# Altium schematic sheet JTAG&CONFIG.SchDoc: JTAG Chain +
size 420 x 297 mm; CheckedBy: MC, TW, EB; CompanyName: CERN; DrawnBy: Greg Kasprowicz; Organization: CERN; Address1: European Organization for Nuclear Research; Address2: CH-1211 Geneve 23 - Switzerland; DocumentNumber: 10; Revision: -; SheetNumber: 10; SheetTotal: 17; EDA_Number: EDA-02189-V4-0; Projet: Simple PCIe Carrier Board; ModifiedBy: TW, MC; CreateDate: 10/07/2010; CheckedDate: 11/05/2011; Title2: FPGA Flash; DivGrp: BE-CO; Designer: GK, MC, TW, EB, PAS; DocumentName: jtag_chain.SchDoc; ModifiedDate: -; Rule: PcbType=ProtelPcb
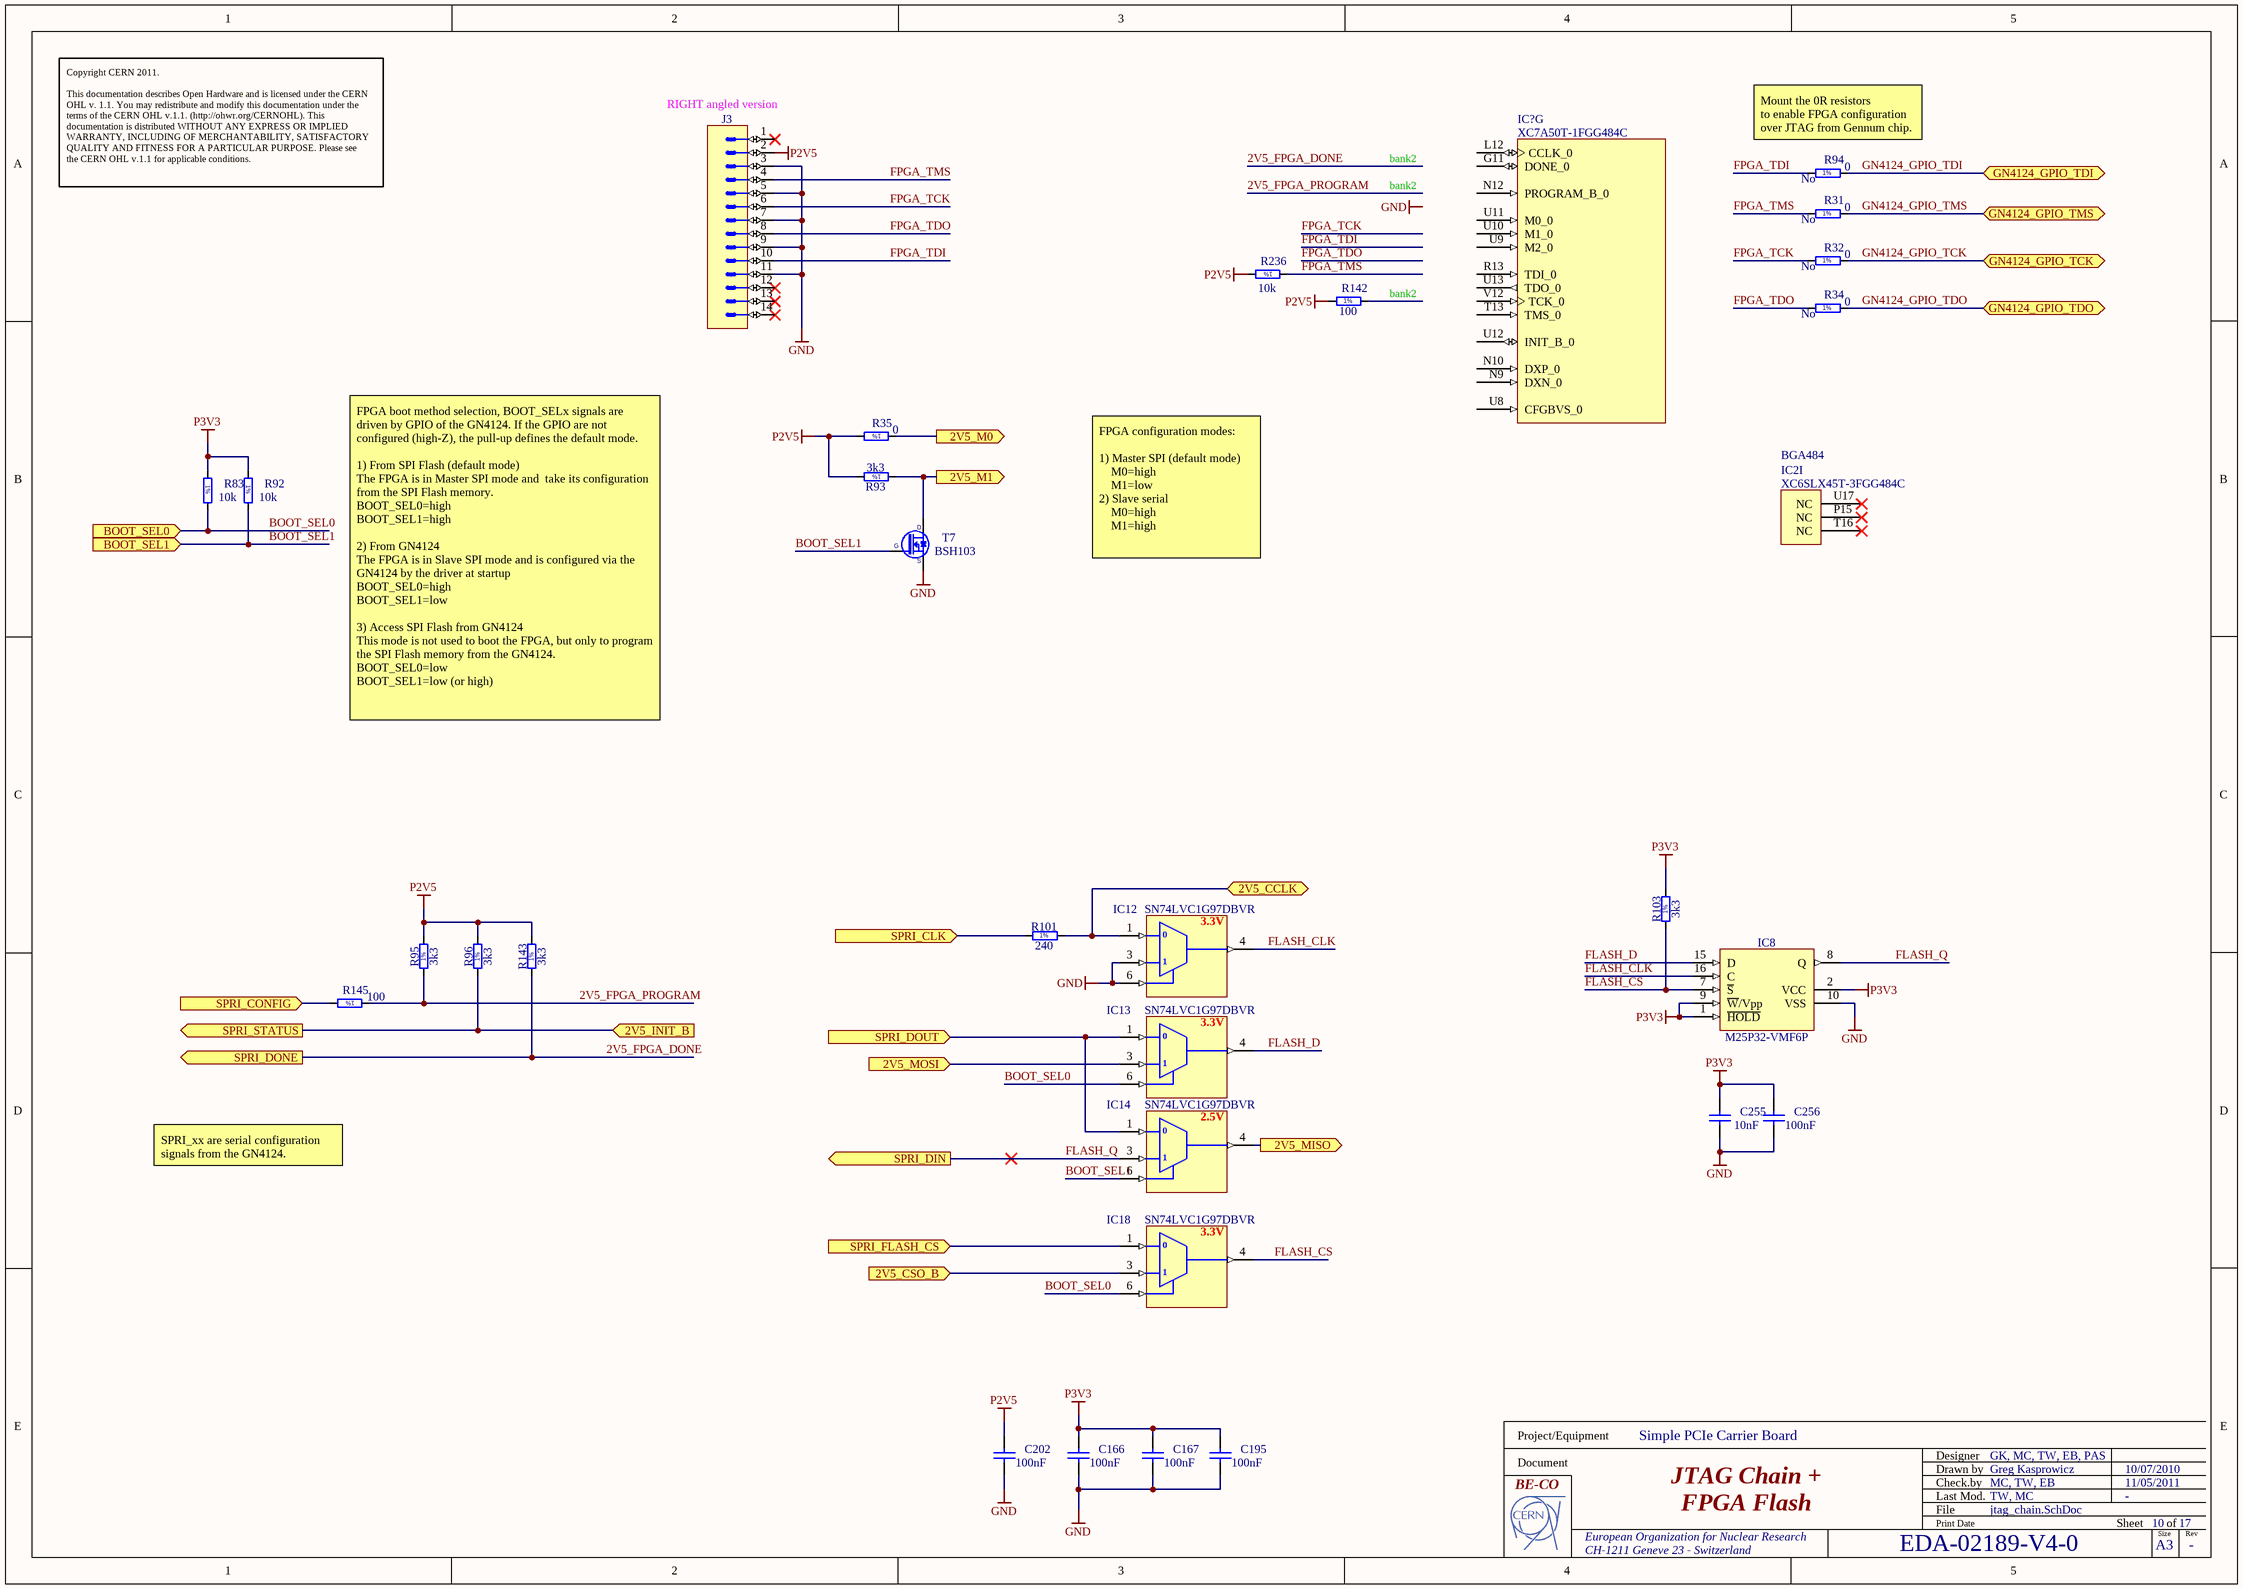
[diagram p0: JTAG&CONFIG.SchDoc]

## Parts
C166  100nF  [CAPC1608X87N]
C167  100nF  [CAPC1608X87N]
C195  100nF  [CAPC1608X87N]
C202  100nF  [CAPC1608X87N]
C255  10nF  [CAPC1608X87N]
C256  100nF  [CAPC1608X87N]
IC2  XC6SLX45T-3FGG484C  Case: BGA484  [BGA484C100P22X22_2300X2300X260]  (part I of 9)
IC8  M25P32-VMF6P  [SOIC127P1030X265-16N]
IC12  SN74LVC1G97DBVR  [SOT95P280X145-6N]
IC13  SN74LVC1G97DBVR  [SOT95P280X145-6N]
IC14  SN74LVC1G97DBVR  [SOT95P280X145-6N]
IC18  SN74LVC1G97DBVR  [SOT95P280X145-6N]
IC?  XC7A50T-1FGG484C  [BGA484C100P22X22_2300X2300X260]  (part G of 11)
J3  Milli-Grid™  [MOLEX_87833-1420]  (value not drawn)
R31  0  Mounted: No  [RESC1608X55N]
R32  0  Mounted: No  [RESC1608X55N]
R34  0  Mounted: No  [RESC1608X55N]
R35  0  [RESC1608X55N]
R83  10k  [RESC1608X55N]
R92  10k  [RESC1608X55N]
R93  3k3  [RESC1608X55N]
R94  0  Mounted: No  [RESC1608X55N]
R95  3k3  [RESC1608X55N]
R96  3k3  [RESC1608X55N]
R101  240  [RESC1608X55N]
R103  3k3  [RESC1608X55N]
R142  100  [RESC1608X55N]
R143  3k3  [RESC1608X55N]
R145  100  [RESC1608X55N]
R236  10k  [RESC1608X55N]
T7  BSH103  [SOT95P230X110-3N]

## Ports
2V5_CCLK (bidir), 2V5_CSO_B (in), 2V5_INIT_B (in), 2V5_M0 (out), 2V5_M1 (out), 2V5_MISO (out), 2V5_MOSI (in), BOOT_SEL0 (in), BOOT_SEL1 (in), GN4124_GPIO_TCK (bidir), GN4124_GPIO_TDI (bidir), GN4124_GPIO_TDO (bidir), GN4124_GPIO_TMS (bidir), SPRI_CLK (in), SPRI_CONFIG (in), SPRI_DIN (out), SPRI_DONE (out), SPRI_DOUT (in), SPRI_FLASH_CS (in), SPRI_STATUS (out)

## Nets
GND: C166.1 C167.1 C195.1 C202.1 C255.1 C256.1 IC8.10(VSS) IC12.2(GND) IC12.3(IN0) IC12.6(IN2) IC13.2(GND) IC14.2(GND) IC18.2(GND) J3.3 J3.5 J3.7 J3.9 J3.11 T7.2(S)
P2V5: C202.2 IC14.5(VCC) J3.2 R35.2 R93.2 R95.2 R96.2 R142.1 R143.2 R236.2
P3V3: C166.2 C167.2 C195.2 C255.2 C256.2 IC8.1(~{HOLD}) IC8.2(VCC) IC8.9(~{W}/Vpp) IC12.5(VCC) IC13.5(VCC) IC18.5(VCC) R83.1 R92.1 R103.2
2V5_CCLK: IC12.1(IN1) R101.2 ; port 2V5_CCLK
2V5_CSO_B: IC18.3(IN0) ; port 2V5_CSO_B
2V5_FPGA_DONE: R143.1 ; port SPRI_DONE
2V5_FPGA_PROGRAM: R95.1 R145.1
2V5_INIT_B: R96.1 ; port SPRI_STATUS, port 2V5_INIT_B
2V5_M0: R35.1 ; port 2V5_M0
2V5_M1: R93.1 T7.3(D) ; port 2V5_M1
2V5_MISO: IC14.4(Y) ; port 2V5_MISO
2V5_MOSI: IC13.3(IN0) ; port 2V5_MOSI
BOOT_SEL0: IC13.6(IN2) IC18.6(IN2) R83.2 ; port BOOT_SEL0
BOOT_SEL1: IC14.6(IN2) R92.2 T7.1(G) ; port BOOT_SEL1
FLASH_CLK: IC8.16(C) IC12.4(Y)
FLASH_CS: IC8.7(~{S}) IC18.4(Y) R103.1
FLASH_D: IC8.15(D) IC13.4(Y)
FLASH_Q: IC8.8(Q) IC14.3(IN0) ; port SPRI_DIN
FPGA_TCK: J3.6 R32.1
FPGA_TDI: J3.10 R94.1
FPGA_TDO: J3.8 R34.1
FPGA_TMS: J3.4 R31.1 R236.1
GN4124_GPIO_TCK: R32.2 ; port GN4124_GPIO_TCK
GN4124_GPIO_TDI: R94.2 ; port GN4124_GPIO_TDI
GN4124_GPIO_TDO: R34.2 ; port GN4124_GPIO_TDO
GN4124_GPIO_TMS: R31.2 ; port GN4124_GPIO_TMS
SPRI_CLK: R101.1 ; port SPRI_CLK
SPRI_CONFIG: R145.2 ; port SPRI_CONFIG
SPRI_DOUT: IC13.1(IN1) IC14.1(IN1) ; port SPRI_DOUT
SPRI_FLASH_CS: IC18.1(IN1) ; port SPRI_FLASH_CS

Not connected (* = marked no-connect by the designer): IC2 P15(NC)* T16(NC)* U17(NC)*; IC? G11(DONE_0) L12(CCLK_0) N9(DXN_0) N10(DXP_0) N12(PROGRAM_B_0) R13(TDI_0) T13(TMS_0) U8(CFGBVS_0) U9(M2_0) U10(M1_0) U11(M0_0) U12(INIT_B_0) U13(TDO_0) V12(TCK_0); J3 1* 12* 13* 14*; R142 2

## Notes on the sheet
- (near J3) RIGHT angled version
- Copyright CERN 2011.
  This documentation describes Open Hardware and is licensed under the CERN OHL v. 1.1. You may redistribute and modify this documentation under the terms of the CERN OHL v.1.1. (http://ohwr.org/CERNOHL). This documentation is distributed WITHOUT ANY EXPRESS OR IMPLIED WARRANTY, INCLUDING OF MERCHANTABILITY, SATISFACTORY QUALITY AND FITNESS FOR A PARTICULAR PURPOSE. Please see the CERN OHL v.1.1 for applicable conditions.
- bank2
- (near R94) Mount the 0R resistors
  to enable FPGA configuration over JTAG from Gennum chip.
  .
- (near R142) bank2
- FPGA configuration modes:
  1) Master SPI (default mode)
  M0=high
  M1=low
  2) Slave serial
  M0=high
  M1=high
- FPGA boot method selection, BOOT_SELx signals are driven by GPIO of the GN4124. If the GPIO are not configured (high-Z), the pull-up defines the default mode.
  1) From SPI Flash (default mode)
  The FPGA is in Master SPI mode and  take its configuration from the SPI Flash memory.
  BOOT_SEL0=high
  BOOT_SEL1=high
  2) From GN4124
  The FPGA is in Slave SPI mode and is configured via the GN4124 by the driver at startup
  BOOT_SEL0=high
  BOOT_SEL1=low
  3) Access SPI Flash from GN4124
  This mode is not used to boot the FPGA, but only to program the SPI Flash memory from the GN4124.
  BOOT_SEL0=low
  BOOT_SEL1=low (or high)
- (near IC12) 0
- (near IC12) 3.3V
- (near IC12) 1
- (near IC13) 3.3V
- (near IC13) 0
- (near IC13) 1
- (near IC14) 0
- (near IC14) 2.5V
- SPRI_xx are serial configuration signals from the GN4124.
- (near IC14) 1
- (near IC18) 0
- (near IC18) 1
- (near IC18) 3.3V
- Labels drawn without touching a wire or pin: GND
- Project/Equipment
- Document
- Designer
- Drawn by
- Check.by
- File
- Last Mod.
- Print Date
- Sheet
- Size
- A3
- of
- Rev
- (in symbol R0603_0R_JUMPER) 1%
- (in symbol R0603_3K3_1%_0.1W_100PPM) 1%
- (in symbol R0603_10K_1%_0.1W_100PPM) 1%
- (in symbol R0603_100R_1%_0.1W_100PPM) 1%
- (in symbol R0603_240R_1%_0.1W_100PPM) 1%

## Library data of the parts
C166 C167 C195 C202 C256 = CC0603_100NF_50V_10%_X7R: Non-polarised capacitor; Part Description: SMD Multilayer Chip Ceramic Capacitor; Manufacturer: GENERIC; Manufacturer1 Part Number: 223858615649; Voltage: 50V; TC: X7R; Tolerance: ±10%; Table: Capacitors SMD; Part Number: CC0603_100NF_50V_10%_X7R; Component Kind: Standard; Component Type: Standard; Pin Count: 2; Value: 100nF; Status: Preferred; Manufacturer Part Number: CC0603_100NF_50V_10%_X7R; Case: 0603; Mounted: Yes; Socket: No; SMD: Yes; Manufacturer1 Example: PHYCOMP; Manufacturer1 ComponentHeight: 0.87mm; HelpURL: \\cern.ch\dfs\Applications\Altium\Datasheets\CC0603_X7R_PHYCOMP.pdf; Author: CERN DEM JLC; CreateDate: 03/12/2007; LatestRevisionDate: 03/12/2007
C255 = CC0603_10NF_50V_10%_X7R: Non-polarised capacitor; Part Description: SMD Multilayer Chip Ceramic Capacitor; Manufacturer: GENERIC; Manufacturer1 Part Number: 223858615636; Voltage: 50V; TC: X7R; Tolerance: ±10%; Table: Capacitors SMD; Part Number: CC0603_10NF_50V_10%_X7R; Component Kind: Standard; Component Type: Standard; Pin Count: 2; Value: 10nF; Status: Preferred; Manufacturer Part Number: CC0603_10NF_50V_10%_X7R; Case: 0603; Mounted: Yes; Socket: No; SMD: Yes; Manufacturer1 Example: PHYCOMP; Manufacturer1 ComponentHeight: 0.87mm; HelpURL: \\cern.ch\dfs\Applications\Altium\Datasheets\CC0603_X7R_PHYCOMP.pdf; Author: CERN DEM JLC; CreateDate: 03/12/2007; LatestRevisionDate: 03/12/2007
IC2 = XC6SLX45T-3FGG484C: Spartan-6 LXT 1.2V FPGA, 296 User I/Os, 484-Ball Fine-Pitch BGA (1.0mm Pitch), Speed Grade 3, Commercial Grade, Pb-Free; Manufacturer: XILINX; Table: Logic; Part Number: XC6SLX45T-3FGG484C; Component Kind: Standard; Component Type: Standard; Device: XC6SLX45T-3FGG484C; PackageDescription: BGA,1.00mm pitch,square;484 pin,22 columns X 22 rows,23.00mm X 23.00mm X 2.60mm H; Part Description: Spartan-6 LXT 1.2V FPGA, 296 User I/Os, 484-Ball Fine-Pitch BGA (1.0mm Pitch), Speed Grade 3, Commercial Grade, Pb-Free; Manufacturer Part Number: XC6SLX45T-3FGG484C; Pin Count: 484; Mounted: Yes; Socket: No; SMD: Yes; ComponentHeight: 2.6mm; HelpURL: \\cern.ch\dfs\Applications\Altium\Datasheets\XC6SLX45T-3FGG484C.pdf; ComponentLink1URL: \\cern.ch\dfs\Applications\Altium\Datasheets\XC6SLX45T-3FGG484C_Package-Pinouts.pdf; ComponentLink1Description: Package/Pinouts; Author: CERN DEM JLC; CreateDate: 2010-07-08; LatestRevisionDate: 2010-07-08
IC8 = M25P32-VMF6P: 32 Mbit, low-voltage, Serial Flash memory with 75-MHz SPI bus interface; Part Description: 32 Mbit, Low-Voltage, Serial Flash Memory With 75MHz SPI Bus Interface; Manufacturer: MICRON; Table: Logic; Part Number: M25P32-VMF6P; Component Kind: Standard; Component Type: Standard; Device: M25P32-VMF6P; PackageDescription: SOIC 16, Pitch 1.27mm - Body 7.5x10.3mm, IPC Medium Density; Manufacturer Part Number: M25P32-VMF6P; Pin Count: 8; Case: SOIC16; Mounted: Yes; Socket: No; SMD: Yes; ComponentHeight: 2.65mm; HelpURL: \\cern.ch\dfs\Applications\Altium\Datasheets\M25P32-VMF6P.pdf; Author: CERN DEM JLC; CreateDate: 21/10/2010; LatestRevisionDate: 18/07/2011
IC12-IC14 IC18 = SN74LVC1G97DBVR: Configurable Multiple-Function Gate; Manufacturer: TEXAS INSTRUMENTS; Table: Standard Logic; Part Number: SN74LVC1G97DBVR; Component Kind: Standard; Component Type: Standard; Device: SN74LVC1G97DBVR; PackageDescription: SOT23, 6-Leads, Body 3.0x3.0mm (max), Pitch 0.95mm, IPC Medium Density; Part Description: Configurable Multiple-Function Gate; Manufacturer Part Number: SN74LVC1G97DBVR; Pin Count: 6; Case: SOT23-6; Mounted: Yes; Socket: No; SMD: Yes; ComponentHeight: 1.45mm; Author: CERN DEM JLC; HelpURL: \\cern.ch\dfs\Applications\Altium\Datasheets\SN74LVC1G97DBVR.pdf; CreateDate: 2/15/2011; LatestRevisionDate: 2/15/2011
IC? = XC7A50T-1FGG484C: Artix-7 FPGA, 4 GTPs, 250 User I/Os, 484-Ball Fine-Pitch Thin BGA (1.0mm Pitch), Speed Grade 1, Commercial Grade, Pb-Free; Manufacturer: XILINX; PressFit: No; Bonding: No; Part Number: XC7A50T-1FGG484C; Component Kind: Standard; Component Type: Standard; Device: XC7A50T-1FGG484C; PackageDescription: BGA, 1.00mm Pitch, Square; 484 Pin, 22 Columns x 22 Rows, Body 23mm X 23mm X 2.60mm H, IPC Medium Density; Part Description: Artix-7 FPGA, 4 GTPs, 250 User I/Os, 484-Ball Fine-Pitch Thin BGA (1.0mm Pitch), Speed Grade 1, Commercial Grade, Pb-Free; Manufacturer Part Number: XC7A50T-1FGG484C; Pin Count: 484; Case: BGA484; Mounted: Yes; Socket: No; SMD: Yes; Sense: No; ComponentHeight: 2.6mm; HelpURL: \\cern.ch\dfs\Applications\Altium\Datasheets\XC7A50T-1FGG484C.pdf; ComponentLink1URL: \\cern.ch\dfs\Applications\Altium\Datasheets\XC7A50T-1FGG484C_Package-Pinout.pdf; ComponentLink1Description: Package/Pinout; Author: CERN DEM BC; CreateDate: 27.07.2015; LatestRevisionDate: 27.07.2015
J3 = MOLEX_87833-1420: Connector 14 Male; Part Description: 2.00mm (.079") Pitch Milli-Grid™ Header, Right Angle, Shrouded, Center Polarization Slot, Locking Window, 14 Circuits; Manufacturer: MOLEX; Part Number: MOLEX_87833-1420; Component Kind: Standard; Component Type: Standard; Pin Count: 14; Family: Milli-Grid™; Mounted: Yes; Socket: No; SMD: No; Status: None; Manufacturer Part Number: 87833-1420; ComponentHeight: 6.3mm; HelpURL: \\cern.ch\dfs\Applications\Altium\Datasheets\MOLEX_87833-1420.pdf; Author: CERN DEM JLC; CreateDate: 12/01/2009; LatestRevisionDate: 12/01/2009; Table: MOLEX
R31 R32 R34 R35 R94 = R0603_0R_JUMPER: Resistor - 1%; Part Description: 1A (0.05R Max DC Resistance) Zero Ohm Jumper; Manufacturer: GENERIC; Manufacturer1 Part Number: NRC06Z0; Table: Resistors SMD; Part Number: R0603_0R_JUMPER; Component Kind: Standard; Component Type: Standard; Pin Count: 2; Value: 0; Status: Preferred; Manufacturer Part Number: R0603_0R_JUMPER; Case: 0603; Socket: No; SMD: Yes; Manufacturer1 Example: NIC COMPONENT; Manufacturer1 ComponentHeight: 0.55mm; HelpURL: \\cern.ch\dfs\Applications\Altium\Datasheets\R0603_NIC_NRC.pdf; Author: CERN DEM JLC; CreateDate: 12/3/2007; LatestRevisionDate: 3/13/2008
  R35: Mounted: Yes
R83 R92 R236 = R0603_10K_1%_0.1W_100PPM: Resistor - 1%; Part Description: General Purpose Thick Film Chip Resistor; Manufacturer: GENERIC; Manufacturer1 Part Number: NRC06F1002TRF; Power: 0.1W; TC: ±100ppm/°C; Table: Resistors SMD; Part Number: R0603_10K_1%_0.1W_100PPM; Component Kind: Standard; Component Type: Standard; Pin Count: 2; Value: 10k; Status: Preferred; Tolerance: ±1%; Manufacturer Part Number: R0603_10K_1%_0.1W_100PPM; Case: 0603; Mounted: Yes; Socket: No; SMD: Yes; Manufacturer1 Example: NIC COMPONENT; Manufacturer1 ComponentHeight: 0.55mm; HelpURL: \\cern.ch\dfs\Applications\Altium\Datasheets\R0603_NIC_NRC.pdf; Author: CERN DEM JLC; CreateDate: 12/3/2007; LatestRevisionDate: 3/13/2008
R93 R95 R96 R103 R143 = R0603_3K3_1%_0.1W_100PPM: Resistor - 1%; Part Description: General Purpose Thick Film Chip Resistor; Manufacturer: GENERIC; Manufacturer1 Part Number: NRC06F3301TRF; Power: 0.1W; TC: ±100ppm/°C; Table: Resistors SMD; Part Number: R0603_3K3_1%_0.1W_100PPM; Component Kind: Standard; Component Type: Standard; Pin Count: 2; Value: 3k3; Status: Preferred; Tolerance: ±1%; Manufacturer Part Number: R0603_3K3_1%_0.1W_100PPM; Case: 0603; Mounted: Yes; Socket: No; SMD: Yes; Manufacturer1 Example: NIC COMPONENT; Manufacturer1 ComponentHeight: 0.55mm; HelpURL: \\cern.ch\dfs\Applications\Altium\Datasheets\R0603_NIC_NRC.pdf; Author: CERN DEM JLC; CreateDate: 12/3/2007; LatestRevisionDate: 3/13/2008
R101 = R0603_240R_1%_0.1W_100PPM: Resistor - 1%; Part Description: General Purpose Thick Film Chip Resistor; Manufacturer: GENERIC; Manufacturer1 Part Number: NRC06F2400TRF; Power: 0.1W; TC: ±100ppm/°C; Table: Resistors SMD; Part Number: R0603_240R_1%_0.1W_100PPM; Component Kind: Standard; Component Type: Standard; Pin Count: 2; Value: 240; Status: Preferred; Tolerance: ±1%; Manufacturer Part Number: R0603_240R_1%_0.1W_100PPM; Case: 0603; Mounted: Yes; Socket: No; SMD: Yes; Manufacturer1 Example: NIC COMPONENT; Manufacturer1 ComponentHeight: 0.55mm; HelpURL: \\cern.ch\dfs\Applications\Altium\Datasheets\R0603_NIC_NRC.pdf; Author: CERN DEM JLC; CreateDate: 12/3/2007; LatestRevisionDate: 3/13/2008
R142 R145 = R0603_100R_1%_0.1W_100PPM: Resistor - 1%; Part Description: General Purpose Thick Film Chip Resistor; Manufacturer: GENERIC; Manufacturer1 Part Number: NRC06F4700TRF; Power: 0.1W; TC: ±100ppm/°C; Table: Resistors SMD; Part Number: R0603_100R_1%_0.1W_100PPM; Component Kind: Standard; Component Type: Standard; Pin Count: 2; Value: 100; Status: Preferred; Tolerance: ±1%; Manufacturer Part Number: R0603_100R_1%_0.1W_100PPM; Case: 0603; Mounted: Yes; Socket: No; SMD: Yes; Manufacturer1 Example: NIC COMPONENT; Manufacturer1 ComponentHeight: 0.55mm; HelpURL: \\cern.ch\dfs\Applications\Altium\Datasheets\R0603_NIC_NRC.pdf; Author: CERN DEM JLC; CreateDate: 2007-12-03; LatestRevisionDate: 2008-03-13
T7 = BSH103: N-CHANNEL MOSFET WITH DIODE; Part Description: 50V 200mA N-Channel Enhancement Mode Field-Effect Transistor; Manufacturer: NXP SEMICONDUCTORS; Table: Transistors; Part Number: BSH103; Component Kind: Standard; Component Type: Standard; Device: BSH103; PackageDescription: SOT23, 3 pin, Pitch 0.95mm - 1.3mm W X 2.9mm L X 1.1mm H, IPC Medium Density; Manufacturer Part Number: BSH103; Pin Count: 3; Case: SOT23-3; Mounted: Yes; Socket: No; SMD: Yes; ComponentHeight: 1.1mm; HelpURL: \\cern.ch\dfs\Applications\Altium\Datasheets\BSH103.pdf; Author: CERN DEM JLC; CreateDate: 3/16/2010; LatestRevisionDate: 3/16/2010